# EAGLE design small (EAGLE 6.6.0)
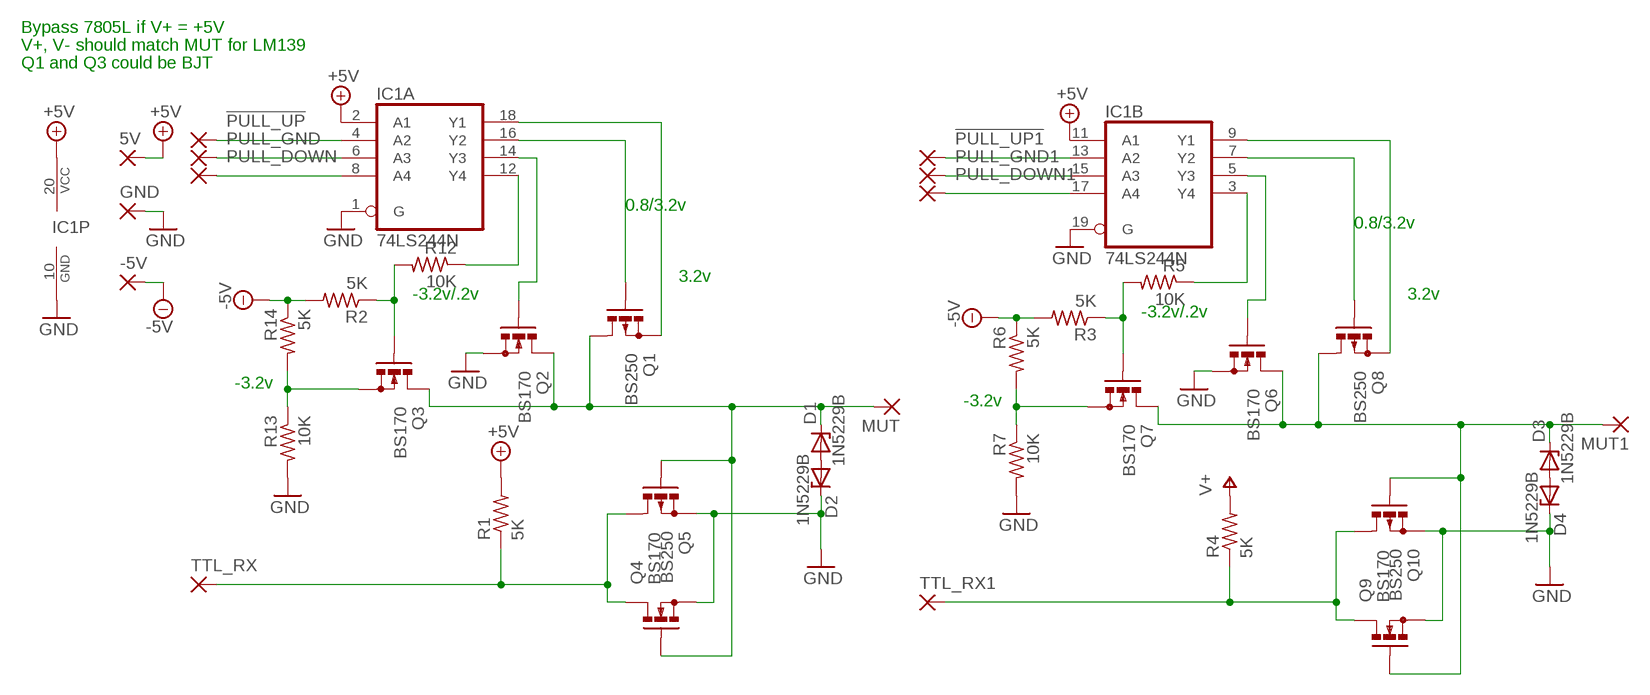
[diagram p0: schematic, sheet 1]

## Parts
5V  1,6/0,9  [1,6/0,9]
!PULL_UP  1,6/0,9  [1,6/0,9]
!PULL_UP1  1,6/0,9  [1,6/0,9]
-5V  1,6/0,9  [1,6/0,9]
D1  1N5229B  ZENER-DIODEDO35Z10  [DO35Z10]
D2  1N5229B  ZENER-DIODEDO35Z10  [DO35Z10]
D3  1N5229B  ZENER-DIODEDO35Z10  [DO35Z10]
D4  1N5229B  ZENER-DIODEDO35Z10  [DO35Z10]
GND  1,6/0,9  [1,6/0,9]
IC1  74LS244N  [DIL20]
MUT  1,6/0,9  [1,6/0,9]
MUT1  1,6/0,9  [1,6/0,9]
PULL_DOWN  1,6/0,9  [1,6/0,9]
PULL_DOWN1  1,6/0,9  [1,6/0,9]
PULL_GND  1,6/0,9  [1,6/0,9]
PULL_GND1  1,6/0,9  [1,6/0,9]
Q1  BS250  [SOT54E]
Q2  BS170  [SOT54E]
Q3  BS170  [SOT54E]
Q4  BS170  [SOT54E]
Q5  BS250  [SOT54E]
Q6  BS170  [SOT54E]
Q7  BS170  [SOT54E]
Q8  BS250  [SOT54E]
Q9  BS170  [SOT54E]
Q10  BS250  [SOT54E]
R1  5K  R-US_0207/10  [0207/10]
R2  5K  R-US_0207/10  [0207/10]
R3  5K  R-US_0207/10  [0207/10]
R4  5K  R-US_0207/10  [0207/10]
R5  10K  R-US_0207/10  [0207/10]
R6  5K  R-US_0207/10  [0207/10]
R7  10K  R-US_0207/10  [0207/10]
R12  10K  R-US_0207/10  [0207/10]
R13  10K  R-US_0207/10  [0207/10]
R14  5K  R-US_0207/10  [0207/10]
TTL_RX  1,6/0,9  [1,6/0,9]
TTL_RX1  1,6/0,9  [1,6/0,9]

## Nets
+5V: 5V.1(P) IC1.2(A:A1) IC1.11(B:A1) IC1.20(P:VCC) R1.2
-5V: -5V.1(P) R2.2 R3.2 R6.1 R14.1
GND: D2.C D4.C GND.1(P) IC1.1(A:G) IC1.10(P:GND) IC1.19(B:G) Q2.S Q4.S Q5.S Q6.S Q9.S Q10.S R7.2 R13.2
N$1: D1.C MUT.1(P) Q1.D Q2.D Q3.D Q4.G Q5.G
N$2: Q3.G R2.1 R12.2
N$3: IC1.6(A:A3) PULL_GND.1(P)
N$4: IC1.8(A:A4) PULL_DOWN.1(P)
N$5: IC1.18(A:Y1) Q1.S
N$6: IC1.16(A:Y2) Q1.G
N$7: D1.A D2.A
N$8: Q4.D Q5.D R1.1 TTL_RX.1(P)
N$9: IC1.12(A:Y4) R12.1
N$10: !PULL_UP.1(P) IC1.4(A:A2)
N$11: IC1.14(A:Y3) Q2.G
N$12: IC1.15(B:A3) PULL_GND1.1(P)
N$13: IC1.17(B:A4) PULL_DOWN1.1(P)
N$14: Q7.G R3.1 R5.2
N$15: Q7.S R6.2 R7.1
N$16: Q3.S R13.1 R14.2
N$17: IC1.9(B:Y1) Q8.S
N$18: D3.C MUT1.1(P) Q6.D Q7.D Q8.D Q9.G Q10.G
N$19: !PULL_UP1.1(P) IC1.13(B:A2)
N$20: D3.A D4.A
N$21: Q9.D Q10.D R4.1 TTL_RX1.1(P)
N$22: IC1.7(B:Y2) Q8.G
N$23: IC1.3(B:Y4) R5.1
N$24: IC1.5(B:Y3) Q6.G
V+: R4.2

## Notes on the sheet
- Bypass 7805L if V+ = +5V
- V+, V- should match MUT for LM139
- Q1 and Q3 could be BJT
- 0.8/3.2v
- 0.8/3.2v
- 3.2v
- -3.2v/.2v | 3.2v
- -3.2v/.2v
- -3.2v
- -3.2v

## Library data of the parts
5V !PULL_UP !PULL_UP1 -5V GND MUT MUT1 PULL_DOWN PULL_DOWN1 PULL_GND PULL_GND1 TTL_RX TTL_RX1 = wirepad:1,6/0,9: THROUGH-HOLE PAD
D1-D4 = diode:ZENER-DIODE: Z-Diode
IC1 = 74xx-us:74*244: Octal BUFFER and LINE DRIVER, 3-state
Q1 Q5 Q8 Q10 = transistor-small-signal:BS250: P-CHANNEL MOS FET
Q2-Q4 Q6 Q7 Q9 = transistor-small-signal:BS170: N-CHANNEL MOS FET
R1-R7 R12-R14 = rcl:R-US_: RESISTOR, American symbol

## Board
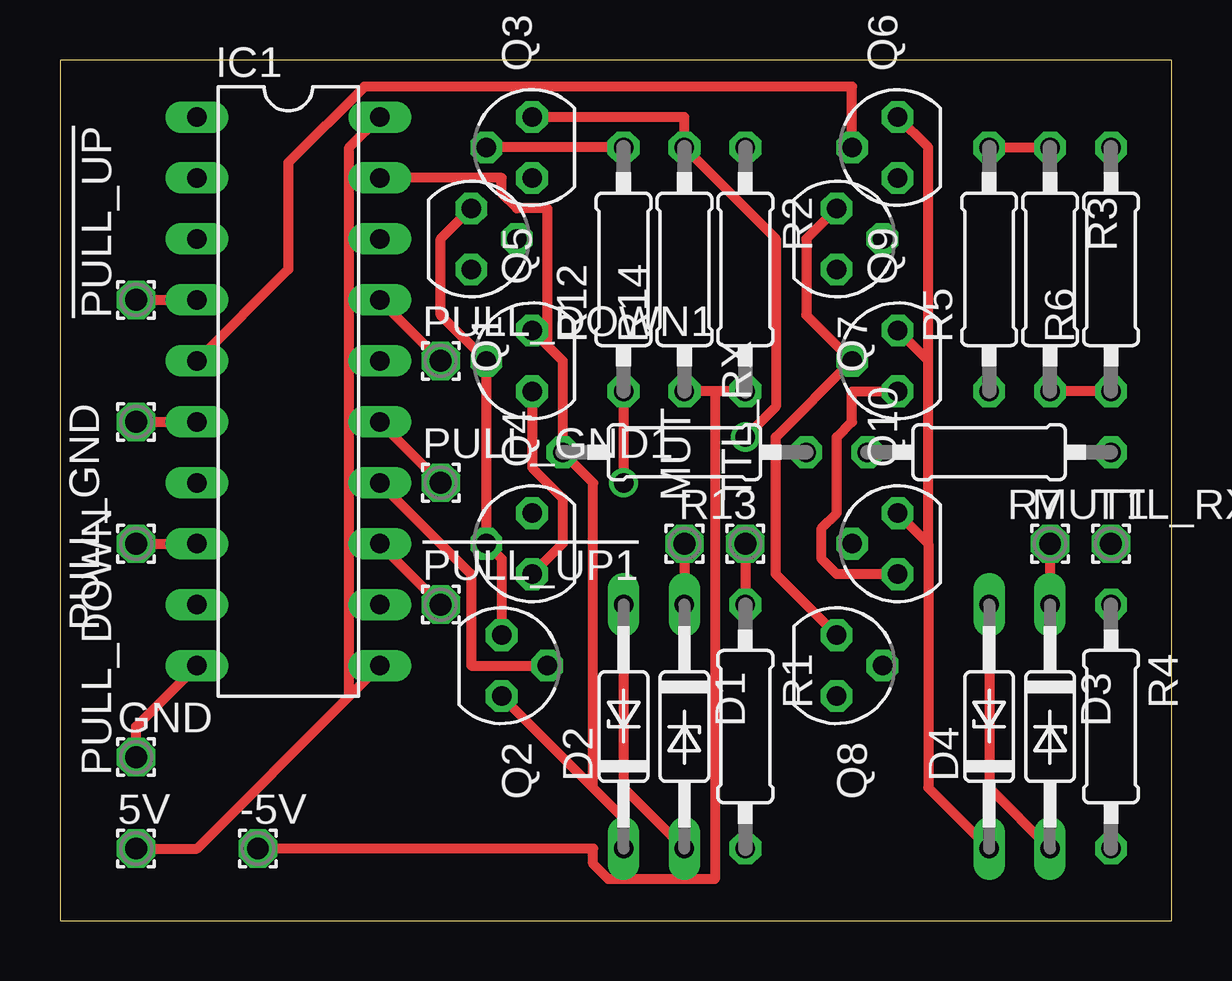
[diagram p1: board, top side]
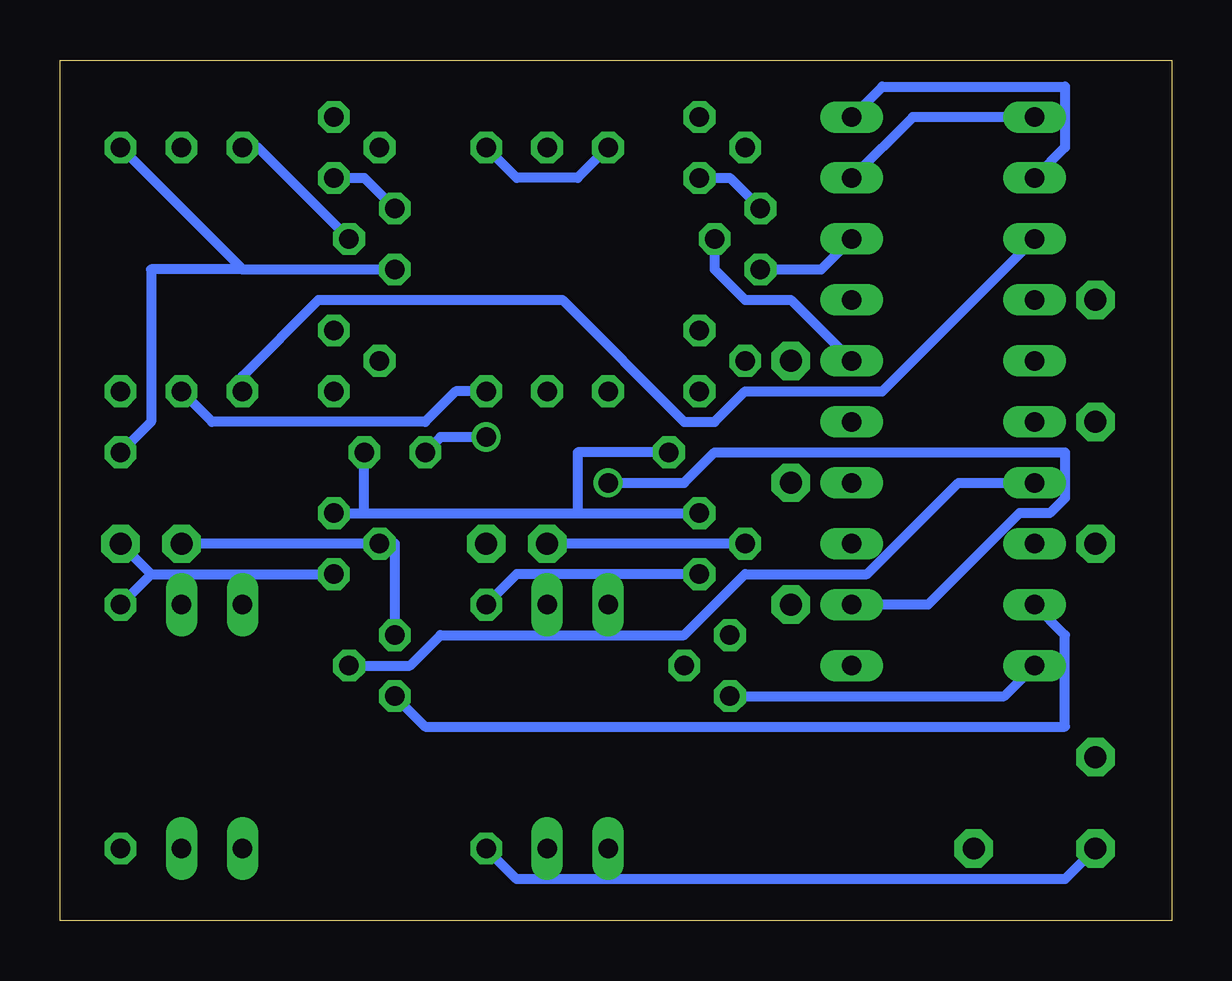
[diagram p2: board, bottom side, seen from below]

Size 46.34 x 35.87 mm. Coordinates in mm from the lower left corner, seen from the top.
Outline: 0,0 46.34,0 46.34,35.87 0,35.87 0,0
Copper layers (1+16): Top 0.035mm / dielectric 1.5mm / Bottom 0.035mm
Design rules "16mils": minimum track width 16mil, minimum drill 32mil, track to track 15mil, track to pad 10mil, pad to pad 10mil, via to via 10mil, smd to smd 10mil, copper to edge 13mil, drill to drill 10mil, minimum pad ring 10mil, minimum via ring 8mil, stop-mask expansion 0mil, vias tented up to drill 0mil, thermal gap 10mil

### Footprints (pad centres in the part's own frame; a part is rotated, then mirrored left to right if it is on the bottom)
1,6/0,9 = drill 0.914 pad 1.6 octagon: 1 0,0
DO35Z10 = drill 0.813 long: A 5.08,0; C -5.08,0
DIL20 = drill 0.813 long: 1 -11.43,-3.81; 2 -8.89,-3.81; 3 -6.35,-3.81; 4 -3.81,-3.81; 5 -1.27,-3.81; 6 1.27,-3.81; 7 3.81,-3.81; 8 6.35,-3.81; 9 8.89,-3.81; 10 11.43,-3.81; 11 11.43,3.81; 12 8.89,3.81; 13 6.35,3.81; 14 3.81,3.81; 15 1.27,3.81; 16 -1.27,3.81; 17 -3.81,3.81; 18 -6.35,3.81; 19 -8.89,3.81; 20 -11.43,3.81
SOT54E = drill 0.813 octagon: D -1.27,0; G 0,1.905; S 1.27,0
0207/10 = drill 0.813 octagon: 1 -5.08,0; 2 5.08,0

### Placement (x,y rotation side)
5V  3.17,3.01 0 top
!PULL_UP  3.17,25.87 90 top
!PULL_UP1  15.87,13.17 0 top
-5V  8.25,3.01 0 top
D1  26.03,8.09 270 top
D2  23.49,8.09 90 top
D3  41.27,8.09 270 top
D4  38.73,8.09 90 top
GND  3.17,6.82 0 top
IC1  9.52,22.06 270 top
MUT  26.03,15.71 90 top
MUT1  41.27,15.71 0 top
PULL_DOWN  3.17,15.71 270 top
PULL_DOWN1  15.87,23.33 0 top
PULL_GND  3.17,20.79 180 top
PULL_GND1  15.87,18.25 0 top
Q1  17.14,28.41 270 top
Q2  18.41,10.63 270 top
Q3  19.68,32.22 90 top
Q4  19.68,15.71 90 top
Q5  19.68,23.33 90 top
Q6  34.92,32.22 90 top
Q7  32.38,28.41 270 top
Q8  32.38,10.63 270 top
Q9  34.92,23.33 90 top
Q10  34.92,15.71 90 top
R1  28.57,8.09 270 top
R2  28.57,27.14 270 top
R3  41.27,27.14 270 top
R4  43.81,8.09 270 top
R5  38.73,27.14 90 top
R6  43.81,27.14 90 top
R7  38.73,19.52 180 top
R12  23.49,27.14 90 top
R13  26.03,19.52 180 top
R14  26.03,27.14 90 top
TTL_RX  28.57,15.71 90 top
TTL_RX1  43.81,15.71 0 top

### Tracks (layer width: path | path; a pad name or v marks a point on that pad's centre or on a via)
+5V
  Top 0.406: 12.06,9.36 5.71,3.01 5V.1 | 12.06,9.36 IC1.11 | IC1.20 12.06,32.22 12.06,9.36
  Bottom 0.406: IC1.2 4.44,32.22 4.44,34.76 12.06,34.76 IC1.20 | R1.2 27.3,1.74 4.44,1.74 5V.1
-5V
  Top 0.406: R6.1 R3.2 | R2.2 27.3,22.06 | 27.3,22.06 R14.1 | -5V.1 22.22,3.01 22.22,2.38 22.86,1.74 27.3,1.74 27.3,22.06
  Bottom 0.406: R3.2 40,20.79 31.11,20.79 29.84,22.06 R2.2
GND
  Top 0.406: D4.C 36.19,5.55 36.19,15.71 | Q10.S 36.19,15.71 | 36.19,23.33 Q9.S | 36.19,15.71 36.19,23.33 | Q6.S 36.19,32.22 36.19,23.33 | IC1.10 3.17,8.09 GND.1 | Q5.S 20.31,23.96 | 20.31,23.96 20.95,23.33 R13.2 22.22,18.25 22.22,5.55 | 22.22,5.55 23.49,4.28 D2.C | 22.22,5.55 Q2.S | IC1.19 18.41,30.95 18.41,30.31 19.04,29.68 20.31,29.68 20.31,23.96
  Bottom 0.406: Q10.S 33.65,16.98 | 33.65,16.98 24.76,16.98 | 24.76,16.98 Q4.S | 33.65,16.98 R7.2 | IC1.19 10.79,33.49 IC1.1 | IC1.10 6.98,9.36 Q2.S | 24.76,16.98 24.76,19.52 R13.2
N$1
  Top 0.406: MUT.1 D1.C | Q2.D 18.41,15.08 Q4.G Q5.G 15.87,25.23 15.87,28.41 Q1.D
  Bottom 0.406: Q1.D 18.41,30.95 Q3.D | Q4.G MUT.1
N$2
  Top 0.406: R12.2 Q3.G
  Bottom 0.406: R2.1 27.3,30.95 24.76,30.95 R12.2
N$3
  Top 0.406: PULL_GND.1 IC1.6
N$4
  Top 0.406: PULL_DOWN.1 IC1.8
N$5
  Bottom 0.406: IC1.18 14.6,27.14 Q1.S
N$6
  Bottom 0.406: IC1.16 15.87,25.87 17.77,25.87 19.04,27.14 Q1.G
N$7
  Top 0.406: D1.A 23.49,5.55 D2.A
N$8
  Top 0.406: TTL_RX.1 R1.1 | Q4.D 20.95,15.71 20.95,17.61 19.68,18.88 Q5.D
  Bottom 0.406: R1.1 27.3,14.44 Q4.D
N$9  (via drill 0.81)
  Top 0.406: R12.1 v23.49,18.25
  Bottom 0.406: IC1.12 10.16,13.17 6.34,16.98 5.08,16.98 4.44,17.61 4.44,19.52 19.04,19.52 20.31,18.25 v23.49,18.25
N$10
  Top 0.406: !PULL_UP.1 IC1.4
N$11
  Top 0.406: Q2.G 17.14,10.63 17.14,14.44 IC1.14
N$12
  Top 0.406: PULL_GND1.1 IC1.15
N$13
  Top 0.406: PULL_DOWN1.1 IC1.17
N$14
  Top 0.406: R5.2 R3.1
  Bottom 0.406: Q7.G 38.1,32.22 R5.2
N$15
  Bottom 0.406: 38.73,27.14 Q7.S | R6.2 38.73,27.14 | R7.1 42.54,20.79 42.54,27.14 38.73,27.14
N$16  (via drill 0.81)
  Top 0.406: v28.57,20.15 29.84,21.42 29.84,28.41 R14.2 26.03,33.49 Q3.S
  Bottom 0.406: R13.1 30.47,20.15 v28.57,20.15
N$17
  Bottom 0.406: IC1.9 4.44,11.9 4.44,8.09 31.11,8.09 Q8.S
N$18
  Top 0.406: Q7.D 31.11,28.41 31.11,25.23 Q9.G 29.84,20.15 29.84,14.44 Q8.D | MUT1.1 D3.C
  Bottom 0.406: Q7.D 33.65,30.95 Q6.D | Q8.D 32.38,15.71 Q10.G MUT1.1
N$19
  Top 0.406: !PULL_UP1.1 IC1.13
N$20
  Top 0.406: D3.A 38.73,5.55 D4.A
N$21
  Top 0.406: Q9.D 33.02,22.06 33.02,20.79 32.38,20.15 32.38,16.98 31.74,16.34 31.74,15.08 32.38,14.44 Q10.D
  Bottom 0.406: 42.54,14.44 Q10.D | TTL_RX1.1 42.54,14.44 | 42.54,14.44 R4.1
N$22
  Bottom 0.406: IC1.7 8.89,18.25 12.7,14.44 17.77,14.44 20.31,11.9 30.47,11.9 31.74,10.63 Q8.G
N$23
  Bottom 0.406: IC1.3 12.06,22.06 17.77,22.06 19.04,20.79 20.31,20.79 25.39,25.87 35.55,25.87 38.73,22.7 R5.1
N$24
  Top 0.406: IC1.5 9.52,27.14 9.52,31.58 12.7,34.76 33.02,34.76 Q6.G